# Altium project Nordic chip IoT PCB.PrjPcb
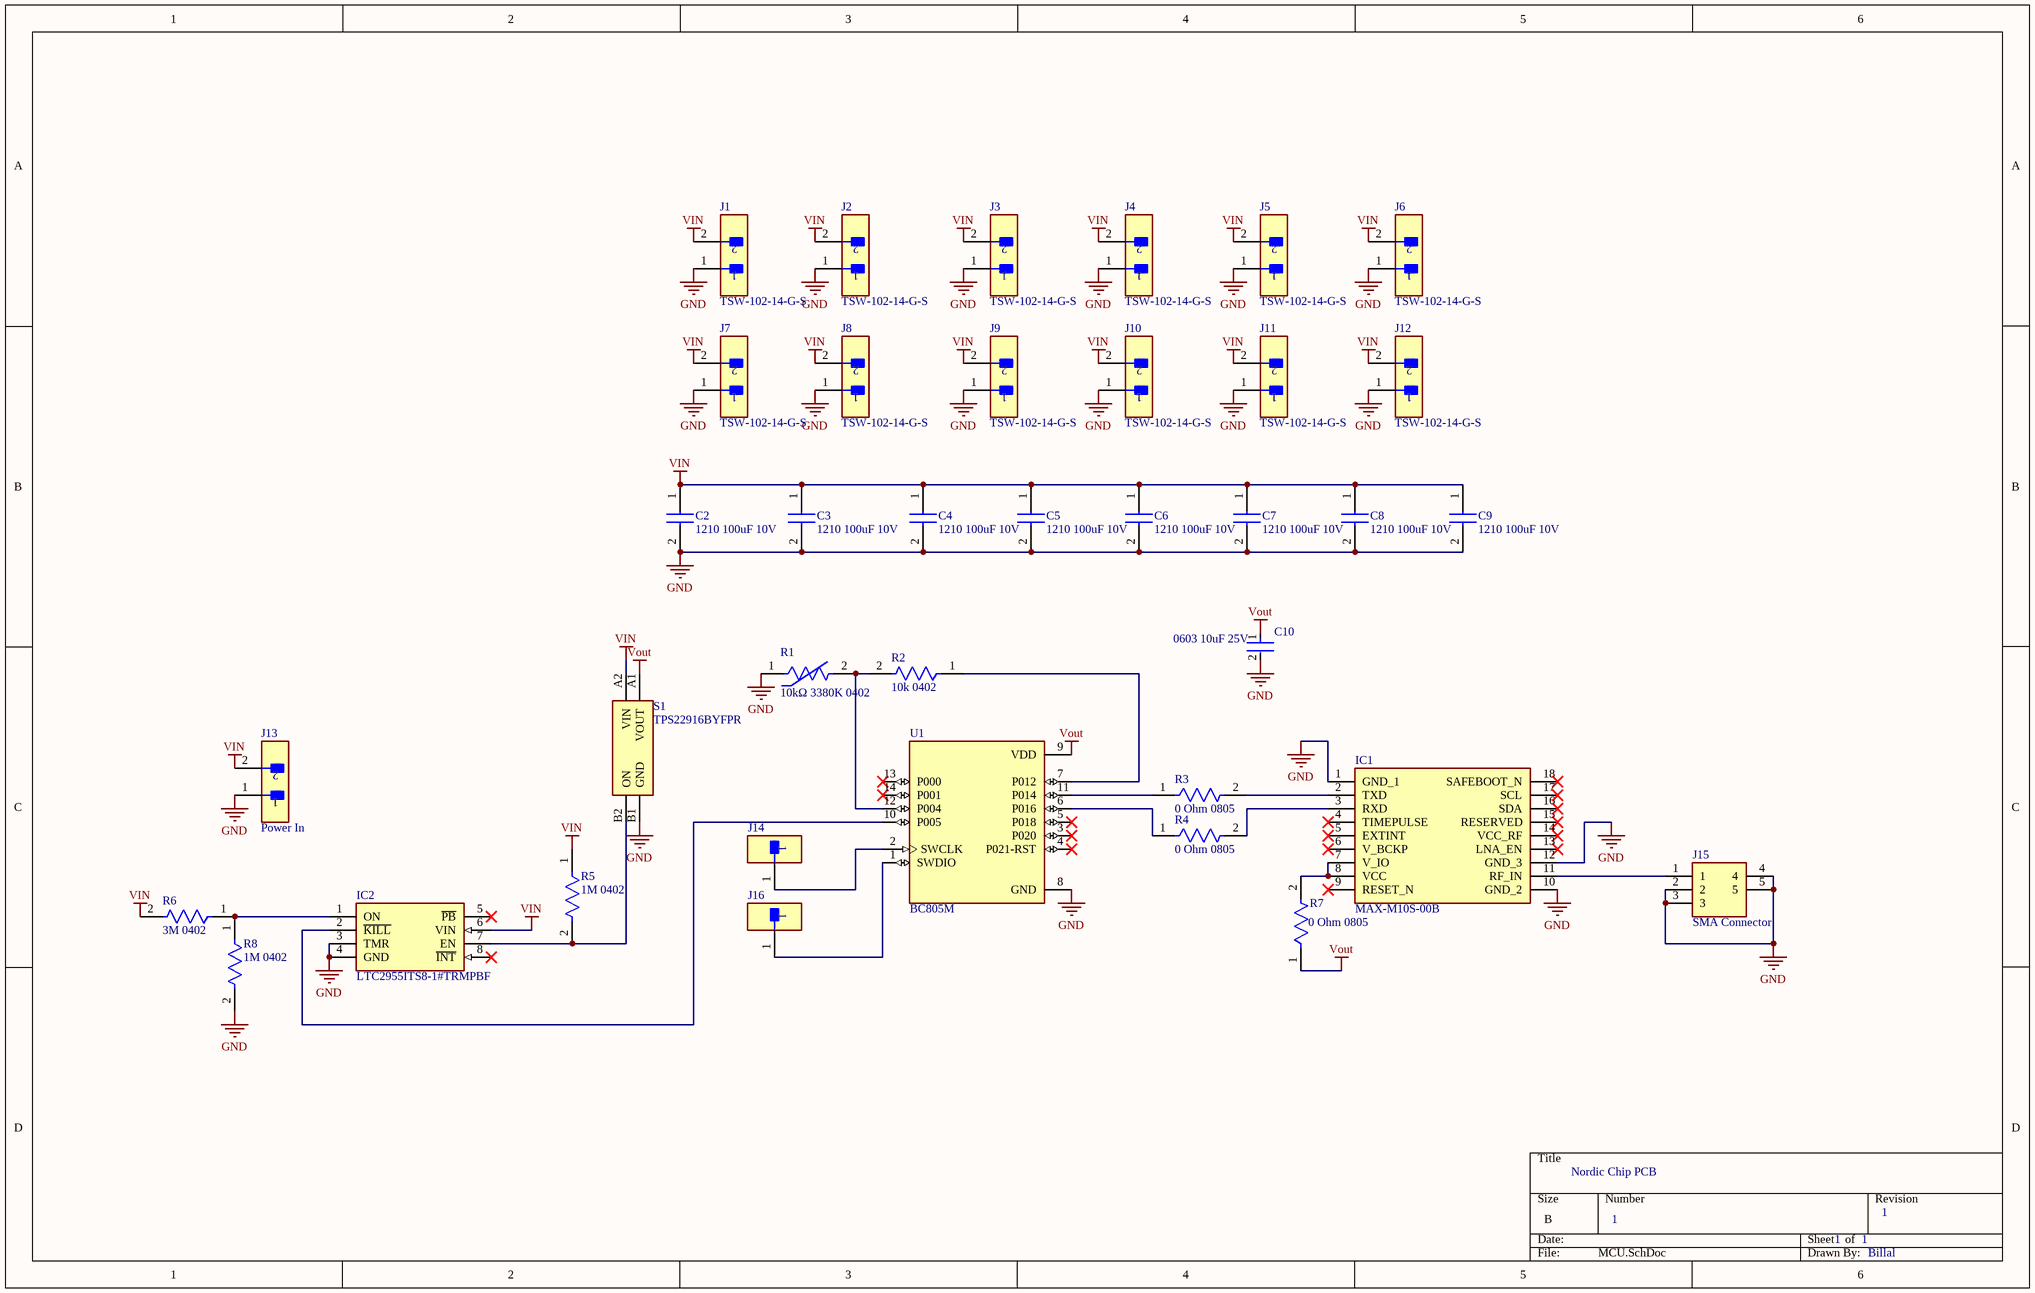
[diagram p0: MCU.SchDoc]
1 sheet, 37 parts. Net scope: global (net labels, ports and power ports of the same name join across sheets).
Board file: PCB1.PcbDoc

## Sheet MCU.SchDoc
size B; SheetNumber: 1; SheetTotal: 1

### Parts
C2  1210 100uF 10V  [CAPC3225X280N]
C3  1210 100uF 10V  [CAPC3225X280N]
C4  1210 100uF 10V  [CAPC3225X280N]
C5  1210 100uF 10V  [CAPC3225X280N]
C6  1210 100uF 10V  [CAPC3225X280N]
C7  1210 100uF 10V  [CAPC3225X280N]
C8  1210 100uF 10V  [CAPC3225X280N]
C9  1210 100uF 10V  [CAPC3225X280N]
C10  0603 10uF 25V  [FP-CC0603-DC-MFG]
IC1  MAX-M10S-00B  [MAXM10S00B]
IC2  LTC2955ITS8-1#TRMPBF  [SOT65P280X100-8N]
J1  TSW-102-14-G-S  [FP-TSW-102-14-G-S-MFG]
J2  TSW-102-14-G-S  [FP-TSW-102-14-G-S-MFG]
J3  TSW-102-14-G-S  [FP-TSW-102-14-G-S-MFG]
J4  TSW-102-14-G-S  [FP-TSW-102-14-G-S-MFG]
J5  TSW-102-14-G-S  [FP-TSW-102-14-G-S-MFG]
J6  TSW-102-14-G-S  [FP-TSW-102-14-G-S-MFG]
J7  TSW-102-14-G-S  [FP-TSW-102-14-G-S-MFG]
J8  TSW-102-14-G-S  [FP-TSW-102-14-G-S-MFG]
J9  TSW-102-14-G-S  [FP-TSW-102-14-G-S-MFG]
J10  TSW-102-14-G-S  [FP-TSW-102-14-G-S-MFG]
J11  TSW-102-14-G-S  [FP-TSW-102-14-G-S-MFG]
J12  TSW-102-14-G-S  [FP-TSW-102-14-G-S-MFG]
J13  Power In  [FP-TSW-102-14-G-S-MFG]
J14  SCL_USB_Power  [FP-TSW-101-07-L-S-MFG]  (value not drawn)
J15  SMA Connector  [733910070]
J16  SCL_USB_Power  [FP-TSW-101-07-L-S-MFG]  (value not drawn)
R1  10kΩ 3380K 0402  [FP-NCP15-NCU15-0_05-IPC_A]
R2  10k 0402  [FP-RMCF0402-MFG]
R3  0 Ohm 0805  [FP-HCJ0805-MFG]
R4  0 Ohm 0805  [FP-HCJ0805-MFG]
R5  1M 0402  [FP-RMCF0402-MFG]
R6  3M 0402  [FP-RMCF0402-MFG]
R7  0 Ohm 0805  [FP-HCJ0805-MFG]
R8  1M 0402  [FP-RMCF0402-MFG]
S1  TPS22916BYFPR  [BGA4C40P2X2_78X78X50]
U1  BC805M  [XCVR_BC805M]

### Nets
GND: C2.2 C3.2 C4.2 C5.2 C6.2 C7.2 C8.2 C9.2 C10.2 IC1.1(GND_1) IC1.10(GND_2) IC1.12(GND_3) IC2.3(TMR) IC2.4(GND) J1.1 J2.1 J3.1 J4.1 J5.1 J6.1 J7.1 J8.1 J9.1 J10.1 J11.1 J12.1 J13.1 J15.2 J15.3 J15.4 J15.5 R1.1 R8.2 S1.B1(GND) U1.8(GND)
VIN: C2.1 C3.1 C4.1 C5.1 C6.1 C7.1 C8.1 C9.1 IC2.6(VIN) J1.2 J2.2 J3.2 J4.2 J5.2 J6.2 J7.2 J8.2 J9.2 J10.2 J11.2 J12.2 J13.2 R5.1 R6.2 S1.A2(VIN)
Vout: C10.1 R7.1 S1.A1(VOUT) U1.9(VDD)
NetIC1_2: IC1.2(TXD) R3.2
NetIC1_3: IC1.3(RXD) R4.2
NetIC1_7: IC1.7(V_IO) IC1.8(VCC) R7.2
NetIC1_11: IC1.11(RF_IN) J15.1
NetIC2_1: IC2.1(ON) R6.1 R8.1
NetIC2_2: IC2.2(~{KILL}) U1.10(P005)
NetIC2_7: IC2.7(EN) R5.2 S1.B2(ON)
NetJ14_1: J14.1 U1.2(SWCLK)
NetJ16_1: J16.1 U1.1(SWDIO)
NetR1_2: R1.2 R2.2 U1.12(P004)
NetR2_1: R2.1 U1.7(P012)
NetR3_1: R3.1 U1.11(P014)
NetR4_1: R4.1 U1.6(P016)

Not connected (* = marked no-connect by the designer): IC1 4(TIMEPULSE)* 5(EXTINT)* 6(V_BCKP)* 9(RESET_N)* 13(LNA_EN)* 14(VCC_RF)* 15(RESERVED)* 16(SDA)* 17(SCL)* 18(SAFEBOOT_N)*; IC2 5(~{PB})* 8(~{INT})*; U1 3(P020)* 4(P021-RST)* 5(P018)* 13(P000)* 14(P001)*

### Notes on the sheet
- Nordic Chip PCB
- 1
- Billal

### Library data of the parts
C2-C9 = CL32A107MPVNNNE: C23742; Manufacturer_Name: SAMSUNG; Datasheet Link: http://uk.rs-online.com/web/p/products/7661179; Height: 2.8mm; Manufacturer_Part_Number: CL32A107MPVNNNE; Mouser Part Number: 187-CL32A107MPVNNNE; Mouser Price/Stock: https://www.mouser.co.uk/ProductDetail/Samsung-Electro-Mechanics/CL32A107MPVNNNE?qs=X6jEic%2FHinBwGsPYz57S5w%3D%3D; Arrow Part Number: CL32A107MPVNNNE; Arrow Price/Stock: https://www.arrow.com/en/products/cl32a107mpvnnne/samsung-electro-mechanics?region=nac
C10 = CMP-00621-81932632-1: C96446; Capacitance: 10µF; Voltage Rating: 16V; Dielectric: X5R; Material: Ceramic; Tolerance: 10%; NexarPartId: 81932632; Height: 1mm; Halogen Free: Halogen Free; Max Operating Temperature: 85°C; Voltage Rating (DC): 16V; Lead Free: Lead Free; RoHS: Non-Compliant; Min Operating Temperature: -55°C; Case/Package: 0603
IC1 = MAX-M10S-00B: C4153167; Manufacturer_Name: u-blox; Datasheet Link: https://content.u-blox.com/sites/default/files/MAX-M10S_IntegrationManual_UBX-20053088.pdf; Height: 2.7mm; Manufacturer_Part_Number: MAX-M10S-00B; Mouser Part Number: 377-MAX-M10S-00B; Mouser Price/Stock: https://www.mouser.co.uk/ProductDetail/u-blox/MAX-M10S-00B?qs=A6eO%252BMLsxmT0PfQYPb7LLQ%3D%3D; Arrow Part Number: MAX-M10S-00B; Arrow Price/Stock: https://www.arrow.com/en/products/max-m10s-00b/u-blox.html?utm_currency=USD&region=nac
IC2 = LTC2955ITS8-1#TRMPBF: C473668; Manufacturer_Name: Analog Devices; Datasheet Link: https://datasheet.datasheetarchive.com/originals/distributors/Datasheets-SFU1/DSASFU10008450.pdf; Height: 1mm; Manufacturer_Part_Number: LTC2955ITS8-1#TRMPBF; Mouser Part Number: 584-C2955ITS8-1TMPF; Mouser Price/Stock: https://www.mouser.co.uk/ProductDetail/Analog-Devices/LTC2955ITS8-1TRMPBF?qs=hVkxg5c3xu8PYYnw8mp%252BwA%3D%3D; Arrow Part Number: LTC2955ITS8-1#TRMPBF; Arrow Price/Stock: https://www.arrow.com/en/products/ltc2955its8-1trmpbf/analog-devices?utm_currency=USD&region=europe
J1-J13 = CMP-02766-001740-1: CONN HEADER VERT 2POS 2.54MM; Number of Positions: 2; Max Current Rating: 7.6A; Gender: Male; Max Voltage Rating (AC): 550V; Contact Mating Length: 0.32inch; REACH SVHC: No SVHC; Width: 2.54mm; Insulation Material: PBT; Contact Shape: Square; Contact Plating: Gold; Min Operating Temperature: -55°C; Contact Material: Bronze; Color: Black; Number of Contacts: 2; Housing Material: Polyester; Orientation: Straight; Flammability Rating: UL94 V-0; Max Operating Temperature: 125°C; Contact Type: Male Pin; Radiation Hardening: No; Termination: Solder; RoHS Compliant: Yes; Lead Free: Lead Free; Fastening Type: Pull; Pitch: 2.54mm; Number of Rows: 1; Series: TSW; Insulation Color: Black; Package Quantity: 1; Connector Type: Header; Length: 5.08mm; Contact Finish - Mating: GOLD; Mount: Through Hole; Housing Color: Black; Depth: 2.54mm; Packaging: Bulk
J14 J16 = CMP-02766-001775-1: CONN HEADER VERT 1POS; Gender: Male; Number of Contacts: 1; Max Current Rating: 7.6A; Max Voltage Rating (AC): 550V; RoHS Compliant: Yes; Contact Finish - Mating: GOLD; Length: 2.54mm; Series: TSW; Insulation Material: PBT; Reach SVHC Compliant: Yes; Radiation Hardening: No; Contact Plating: Gold; Termination: Solder; Contact Type: Male Pin; Orientation: Straight; Number of Rows: 1; Depth: 2.54mm; Housing Material: Polyester; Lead Free: Lead Free; Fastening Type: Pull; Flammability Rating: UL94 V-0; Mount: Through Hole; Housing Color: Black; Contact Shape: Square; Min Operating Temperature: -55°C; Connector Type: Header; Contact Mating Length: 0.23inch; Width: 2.54mm; Packaging: Bulk; Contact Material: Bronze; Max Operating Temperature: 125°C; Number of Positions: 1; Color: Black; Insulation Color: Black
J15 = 73391-0070: C588470; Manufacturer_Name: Molex; Datasheet Link: https://datasheet.datasheetarchive.com/originals/distributors/Datasheets_SAMA/cd6bf19b0e4973497e5cb3fc39017d1b.pdf; Height: 10mm; Manufacturer_Part_Number: 73391-0070; Mouser Part Number: 538-73391-0070; Mouser Price/Stock: https://www.mouser.co.uk/ProductDetail/Molex/73391-0070?qs=Vtbn2VVmZzEJo591qvlOmw%3D%3D
R1 = CMP-06022-000215-2: C178739
R2 R5 R6 R8 = CMP-26527-002093-1: C25744; Max Power Dissipation: 63mW; Tolerance: 5%; Resistance: 3.9R; Temperature Coefficient: 200ppm/°C; Case/Package: 0402; Number of Terminations: 2; Min Operating Temperature: -55°C; Height: 0.016inch; Packaging: Tape and Reel; Resistor Type: Thick Film; Length: 0.039inch; Mount: Surface Mount; Series: RMCF; Max Operating Temperature: 155°C; Contact Plating: Tin; Features: Automotive AEC-Q200; Width: 0.02inch; Radiation Hardening: No; RoHS Compliant: Yes
R3 R4 R7 = CMP-26527-000104-1: C17477; Resistance: 0mR; Radiation Hardening: No; Case Code (Imperial): 0805; Number of Terminations: 2; Lead Free: Lead Free; Max Operating Temperature: 155°C; Width: 0.049inch; Case Code (Metric): 2012; Height: 0.026inch; Mount: Surface Mount; Min Operating Temperature: -55°C; Packaging: Tape and Reel; Package Quantity: 1; Termination: Wraparound; Length: 0.079inch; RoHS Compliant: Yes; Case/Package: 0805
S1 = TPS22916BYFPR: Switch; Manufacturer_Name: Texas Instruments; Datasheet Link: http://www.ti.com/lit/gpn/tps22916; Height: 0.5mm; Manufacturer_Part_Number: TPS22916BYFPR; Mouser Part Number: 595-TPS22916BYFPR; Mouser Price/Stock: https://www.mouser.co.uk/ProductDetail/Texas-Instruments/TPS22916BYFPR?qs=EU6FO9ffTwcHQneHYjMKrg%3D%3D; Arrow Part Number: TPS22916BYFPR; Arrow Price/Stock: https://www.arrow.com/en/products/tps22916byfpr/texas-instruments?region=europe
U1 = BC805M: Bluetooth Bluetooth v5.2 Transceiver Module 2.4GHz PCB Trace Surface Mount; MF: Fanstel Corp.; Package: SMD-14 Fanstel Corp.; Price: None; Check_prices: https://www.snapeda.com/parts/BC805M/Fanstel+Corp./view-part/?ref=eda; Value: *; SnapEDA_Link: https://www.snapeda.com/parts/BC805M/Fanstel+Corp./view-part/?ref=snap; MP: BC805M; Availability: In Stock; Purchase-URL: https://pricing.snapeda.com/search/part/BC805M/?ref=eda